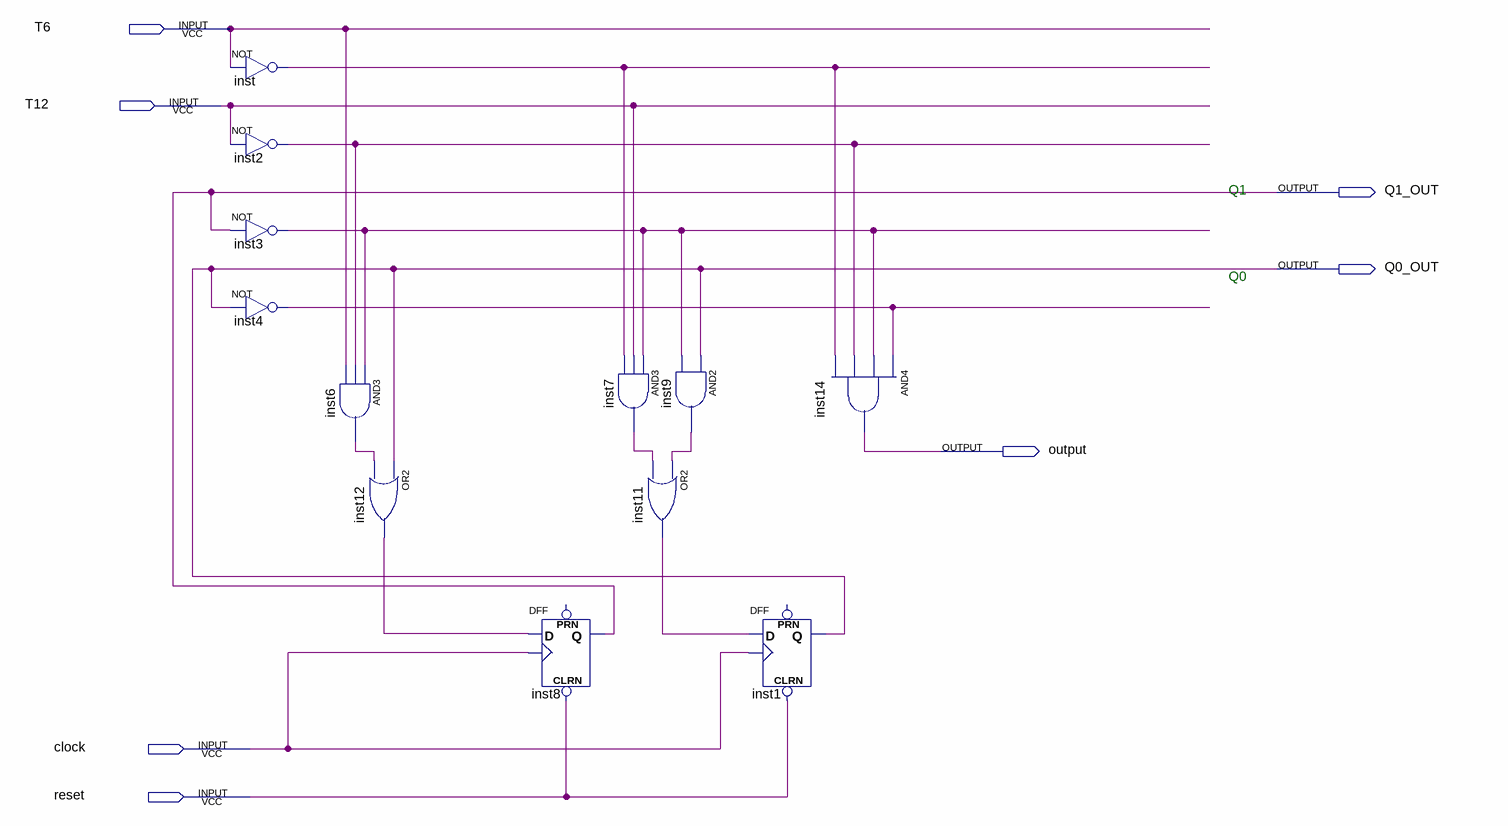
[diagram p0: schematic sheet]
// Quartus schematic 6-12_timer.bdf as structural Verilog: 12 symbols, 7 pins
module \6-12_timer  (
  input  T6,
  input  T12,
  input  clock,
  input  reset,
  output Q1_OUT,
  output Q0_OUT,
  output \output 
);

  wire inst2_out, inst3_out, inst4_out, inst6_out, inst7_out, inst9_out, inst11_out, inst12_out, inst_out;

  not inst (inst_out, T6);
  not inst2 (inst2_out, T12);
  not inst3 (inst3_out, Q1_OUT);
  not inst4 (inst4_out, Q0_OUT);
  and inst6 (inst6_out, inst3_out, inst2_out, T6);
  or inst12 (inst12_out, Q0_OUT, inst6_out);
  DFF inst8 (.CLRN(reset), .CLK(clock), .D(inst12_out), .Q(Q1_OUT));  // open: PRN
  and inst7 (inst7_out, inst3_out, T12, inst_out);
  and inst9 (inst9_out, Q0_OUT, inst3_out);
  or inst11 (inst11_out, inst9_out, inst7_out);
  DFF inst1 (.CLRN(reset), .CLK(clock), .D(inst11_out), .Q(Q0_OUT));  // open: PRN
  and inst14 (\output , inst4_out, inst3_out, inst2_out, inst_out);

  // Notes on the sheet:
  //   Q1
  //   Q0
endmodule
